# Altium project PCB_Project.PrjPcb
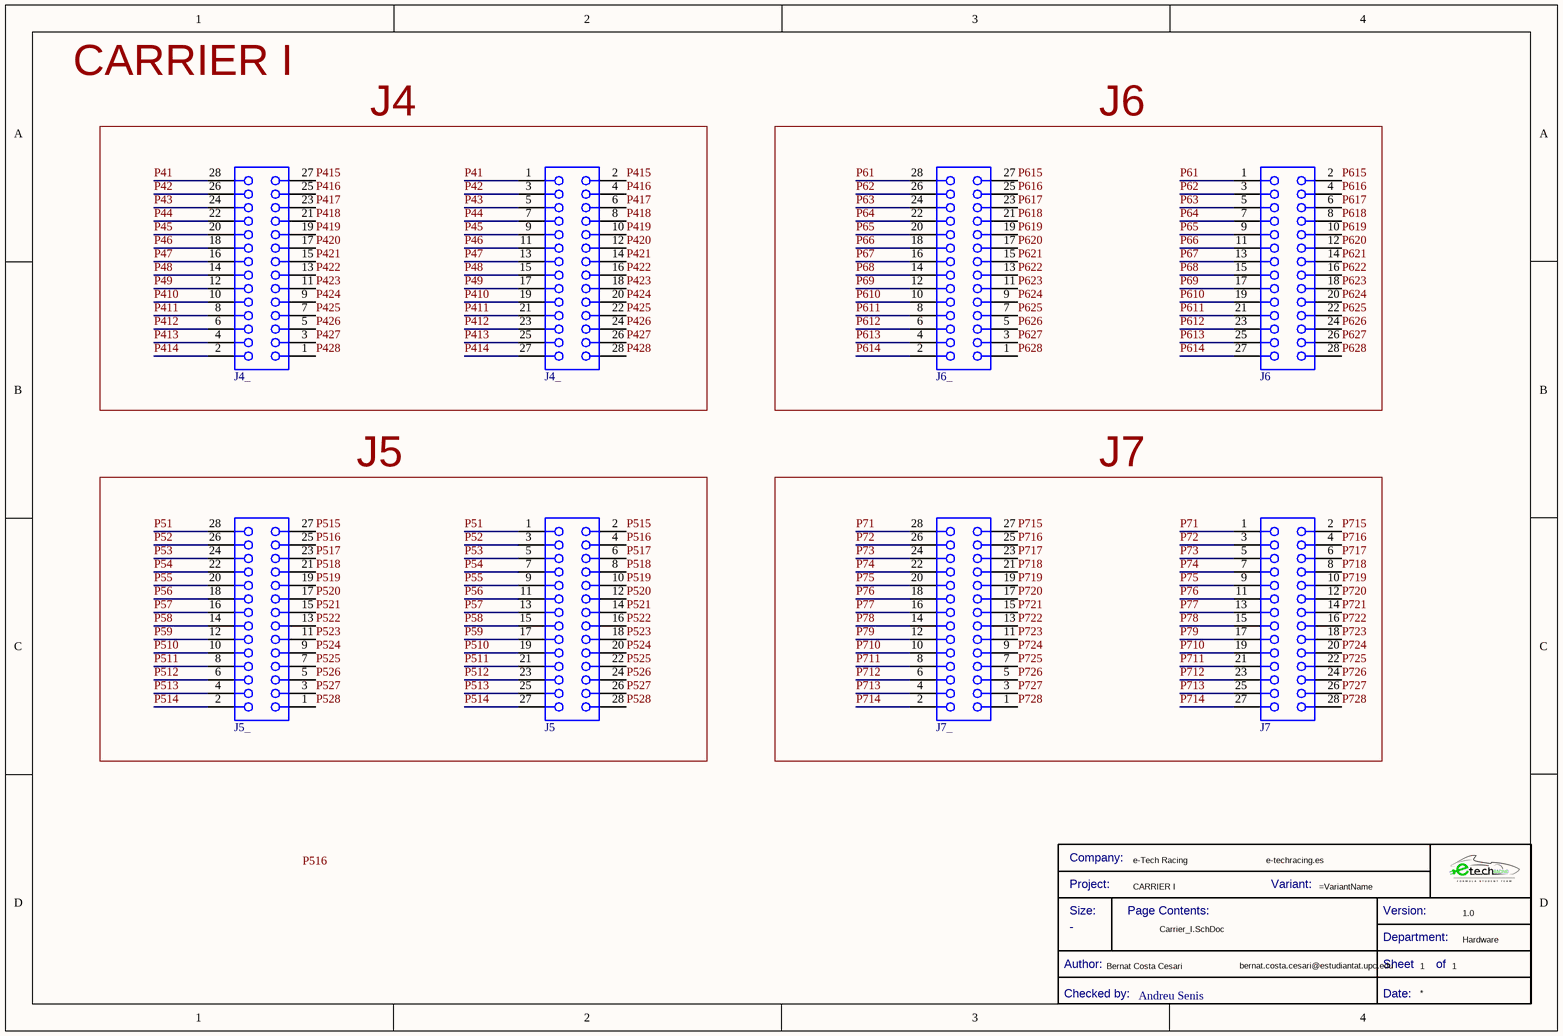
[diagram p0: Carrier_I.SchDoc]
Version: 1.0; ReviewerName: Andreu Senis; Project: CARRIER I; DesignerName: Bernat Costa Cesari; DesignerMail: bernat.costa.cesari@estudiantat.upc.edu; DesignedByURL: e-techracing.es; Department: Hardware; Company: e-Tech Racing
1 sheet, 9 parts. Net scope: global (net labels, ports and power ports of the same name join across sheets).
Board file: Carrier_I_PCB.PcbDoc

## Sheet Carrier_I.SchDoc
size A4; SheetNumber: 1; SheetTotal: 1

### Parts
(Parts that share a designator on the sheet are numbered #1, #2 ... from top to bottom, then left to right.)
*  Checked by:: Andreu Senis  (hidden comment: Title Block_template)  (graphical)
J4_#1  62332821021  [62302821021]  (value not drawn)
J4_#2  61002821821  [61002821821]  (value not drawn)
J5  62332821021  [62302821021]  (value not drawn)
J5_  61002821821  [61002821821]  (value not drawn)
J6  62332821021  [62302821021]  (value not drawn)
J6_  61002821821  [61002821821]  (value not drawn)
J7  62332821021  [62302821021]  (value not drawn)
J7_  61002821821  [61002821821]  (value not drawn)

### Blocks framed on the sheet
J4: J4_#1 J4_#2
J6: J6 J6_
J5: J5 J5_
J7: J7 J7_

### Nets
P41: J4_#1.1 J4_#2.28
P42: J4_#1.3 J4_#2.26
P43: J4_#1.5 J4_#2.24
P44: J4_#1.7 J4_#2.22
P45: J4_#1.9 J4_#2.20
P46: J4_#1.11 J4_#2.18
P47: J4_#1.13 J4_#2.16
P48: J4_#1.15 J4_#2.14
P49: J4_#1.17 J4_#2.12
P51: J5.1 J5_.28
P52: J5.3 J5_.26
P53: J5.5 J5_.24
P54: J5.7 J5_.22
P55: J5.9 J5_.20
P56: J5.11 J5_.18
P57: J5.13 J5_.16
P58: J5.15 J5_.14
P59: J5.17 J5_.12
P61: J6.1 J6_.28
P62: J6.3 J6_.26
P63: J6.5 J6_.24
P64: J6.7 J6_.22
P65: J6.9 J6_.20
P66: J6.11 J6_.18
P67: J6.13 J6_.16
P68: J6.15 J6_.14
P69: J6.17 J6_.12
P71: J7.1 J7_.28
P72: J7.3 J7_.26
P73: J7.5 J7_.24
P74: J7.7 J7_.22
P75: J7.9 J7_.20
P76: J7.11 J7_.18
P77: J7.13 J7_.16
P78: J7.15 J7_.14
P79: J7.17 J7_.12
P410: J4_#1.19 J4_#2.10
P411: J4_#1.21 J4_#2.8
P412: J4_#1.23 J4_#2.6
P413: J4_#1.25 J4_#2.4
P414: J4_#1.27 J4_#2.2
P415: J4_#1.2 J4_#2.27
P416: J4_#1.4 J4_#2.25
P417: J4_#1.6 J4_#2.23
P418: J4_#1.8 J4_#2.21
P419: J4_#1.10 J4_#2.19
P420: J4_#1.12 J4_#2.17
P421: J4_#1.14 J4_#2.15
P422: J4_#1.16 J4_#2.13
P423: J4_#1.18 J4_#2.11
P424: J4_#1.20 J4_#2.9
P425: J4_#1.22 J4_#2.7
P426: J4_#1.24 J4_#2.5
P427: J4_#1.26 J4_#2.3
P428: J4_#1.28 J4_#2.1
P510: J5.19 J5_.10
P511: J5.21 J5_.8
P512: J5.23 J5_.6
P513: J5.25 J5_.4
P514: J5.27 J5_.2
P515: J5.2 J5_.27
P516: J5.4 J5_.25
P517: J5.6 J5_.23
P518: J5.8 J5_.21
P519: J5.10 J5_.19
P520: J5.12 J5_.17
P521: J5.14 J5_.15
P522: J5.16 J5_.13
P523: J5.18 J5_.11
P524: J5.20 J5_.9
P525: J5.22 J5_.7
P526: J5.24 J5_.5
P527: J5.26 J5_.3
P528: J5.28 J5_.1
P610: J6.19 J6_.10
P611: J6.21 J6_.8
P612: J6.23 J6_.6
P613: J6.25 J6_.4
P614: J6.27 J6_.2
P615: J6.2 J6_.27
P616: J6.4 J6_.25
P617: J6.6 J6_.23
P618: J6.8 J6_.21
P619: J6.10 J6_.19
P620: J6.12 J6_.17
P621: J6.14 J6_.15
P622: J6.16 J6_.13
P623: J6.18 J6_.11
P624: J6.20 J6_.9
P625: J6.22 J6_.7
P626: J6.24 J6_.5
P627: J6.26 J6_.3
P628: J6.28 J6_.1
P710: J7.19 J7_.10
P711: J7.21 J7_.8
P712: J7.23 J7_.6
P713: J7.25 J7_.4
P714: J7.27 J7_.2
P715: J7.2 J7_.27
P716: J7.4 J7_.25
P717: J7.6 J7_.23
P718: J7.8 J7_.21
P719: J7.10 J7_.19
P720: J7.12 J7_.17
P721: J7.14 J7_.15
P722: J7.16 J7_.13
P723: J7.18 J7_.11
P724: J7.20 J7_.9
P725: J7.22 J7_.7
P726: J7.24 J7_.5
P727: J7.26 J7_.3
P728: J7.28 J7_.1

### Notes on the sheet
- CARRIER I
- Labels drawn without touching a wire or pin: P516
- (in symbol Title Block_template) Company:; Project:; Variant:; Size:; Page Contents:; Version:; Department:; Author:; Sheet; of; Checked by:; Date:

### Library data of the parts
* = Title Block_template: Standard Title Block; .Creator: GP; Category: Title Block; .PCBcheck: GP; .SCHcheck: GP; Size: -
J4_#1 J5-J7 = 62332821021: WR-PHD Socket Header, SMT, Vertical, pitch 1.27mm, 2 Row, 28P; Manufacturer: Wurth Elektronik; Contact Resistance: 20mΩ; Rated Current: 1A; Working Voltage: 250V; Withstanding Voltage: 500V; ComponentLink1Description: Website Link; ComponentLink1URL: https://www.we-online.com/redexpert/article/62332821021?ad; ComponentLink2Description: Datasheet Link; ComponentLink2URL: https://www.we-online.com/redexpert/spec/62332821021?ad; Manufacturer Part Number: 62332821021; Category: Board-to-Board Connectors; Match Code: WR-PHD; Mount: Surface Mount; Operating Temperature Max: 105°C; Operating Temperature Min: -40°C; Packaging: Tape and Reel; Gender: Socket Header; Number of Pins: 28; Number of Rows: 2; Orientation: Vertical; Pitch: 1.27mm
J4_#2 J5_ J6_ J7_ = 61002821821: WR-PHD Socket Header, SMT, Vertical, pitch 2.54mm, 2 Row, 28P; Manufacturer: Wurth Elektronik; Contact Resistance: 20mΩ; Rated Current: 3A; Working Voltage: 250V; Withstanding Voltage: 600V; ComponentLink1Description: Website Link; ComponentLink1URL: https://www.we-online.com/redexpert/article/61002821821?ad; ComponentLink2Description: Datasheet Link; ComponentLink2URL: https://www.we-online.com/redexpert/spec/61002821821?ad; Manufacturer Part Number: 61002821821; Category: Board-to-Board Connectors; Match Code: WR-PHD; Mount: Surface Mount; Operating Temperature Max: 105°C; Operating Temperature Min: -40°C; Packaging: Tube; Gender: Socket Header; Number of Pins: 28; Number of Rows: 2; Orientation: Vertical; Pitch: 2.54mm